# Altium schematic sheet 5V0.SchDoc
size 209 x 297 mm; DocumentCode: Децимальный номер; SchemeType: Схема электрическая принципиальная; PageSetup: Record=PageOptionsZCenterHorizontal=TrueZCenterVertical=TrueZPrintScale=0.95ZXCorrection=1.00ZYCorrection=1.00ZPrintKind=2ZBorderSize=5000000ZLeftOffset=0ZBottomOffset=0ZOrientation=1ZPaperLength=1000ZPaperWidth=1000ZScale=100ZPaperSource=7ZPrintQuality=600ZMediaType=1ZDitherType=10ZPaperKind=A4 (210 x 297 мм)ZPrintScaleMode=1
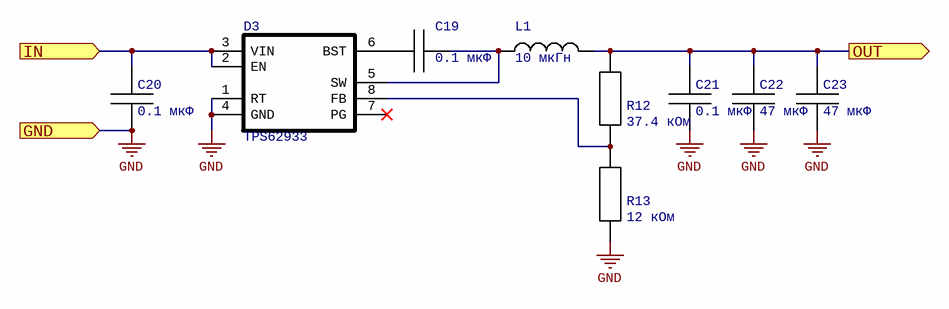
[diagram p0: 5V0.SchDoc]

## Parts
C19  value 0.1 мкФ  [STD-0402]  (hidden comment: cap)
C20  value 0.1 мкФ  [STD-0402]  (hidden comment: cap)
C21  value 0.1 мкФ  [STD-0402]  (hidden comment: cap)
C22  value 47 мкФ  [STD-0805]  (hidden comment: cap)
C23  value 47 мкФ  [STD-0805]  (hidden comment: cap)
D3  TPS62933  [SOT-583]
L1  value 10 мкГн  [IND-0630]  (hidden comment: ind)
R12  value 37.4 кОм  [STD-0402]  (hidden comment: res)
R13  value 12 кОм  [STD-0402]  (hidden comment: res)

## Ports
GND (in), IN (in), OUT (out)

## Nets
GND: C20.1 C21.1 C22.1 C23.1 D3.1(RT) D3.4(GND) R13.1 ; port GND
IN: C20.2 D3.2(EN) D3.3(VIN) ; port IN
OUT: C21.2 C22.2 C23.2 L1.2 R12.2 ; port OUT
NetC19_1: C19.1 D3.5(SW) L1.1
NetC19_2: C19.2 D3.6(BST)
NetD3_8: D3.8(FB) R12.1 R13.2

Not connected (* = marked no-connect by the designer): D3 7(PG)*

## Notes on the sheet
- Перв. примен.
- Справ. №
- Подп. и дата
- Инв. № дубл.
- Взам. инв. №
- Изм.
- Лист
- № докум.
- Подп.
- Дата
- Инв. № подл.
- Копировал
- Формат А4

## Library data of the parts
C19-C21 = C0402-0u1-50v-10%-X7R: Конденсатор; Part Number: C0402-0u1-50v-10%-X7R
C22 C23 = C0805-47u-6.3v-20%-X5R: Конденсатор; Part Number: C0805-47u-6.3v-20%-X5R
D3 = TPS62933PDRLR: DC-DC; Part Number: TPS62933PDRLR
L1 = CKST0603-10: Индуктивность; Part Number: CKST0603-10
R12 = R0402-37k4-1%-1/16W: Резистор; Part Number: R0402-37k4-1%-1/16W
R13 = R0402-12k-1%-1/16W: Резистор; Part Number: R0402-12k-1%-1/16W